# EAGLE schematic POWER SUPPLY - Copy (EAGLE 6.1)
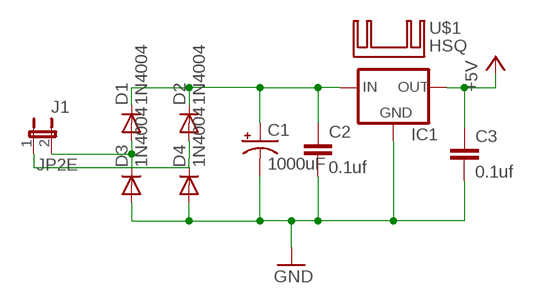
[diagram p0: schematic, sheet 1]

## Parts
C1  1000uF  CPOL-USE3.5-8  [E3,5-8]
C2  0.1uf  C-EU025-024X044  [C025-024X044]
C3  0.1uf  C-EU025-024X044  [C025-024X044]
D1  1N4004  [DO41-10]
D2  1N4004  [DO41-10]
D3  1N4004  [DO41-10]
D4  1N4004  [DO41-10]
IC1  78XXS  [78XXS]
J1  JP2E  [JP2]
U$1  HSQ  [HEATSINK]

## Nets
+5V: C3.1 IC1.OUT
GND: C1.- C2.2 C3.2 D3.A D4.A IC1.GND
N$1: C1.+ C2.1 D1.C D2.C IC1.IN
N$2: D1.A D3.C J1.2
N$3: D2.A D4.C J1.1

## Library data of the parts
C1 = resistor:CPOL-US: POLARIZED CAPACITOR, American symbol
C2 C3 = resistor:C-EU: CAPACITOR, European symbol
D1-D4 = diode:1N4004: DIODE general purpose rectifier, 1 A
IC1 = v-reg:78XXS: VOLTAGE REGULATOR
J1 = relimate:JP2E
U$1 = HEATSINK:HS